# EAGLE design half-stick (EAGLE 6.5.0)
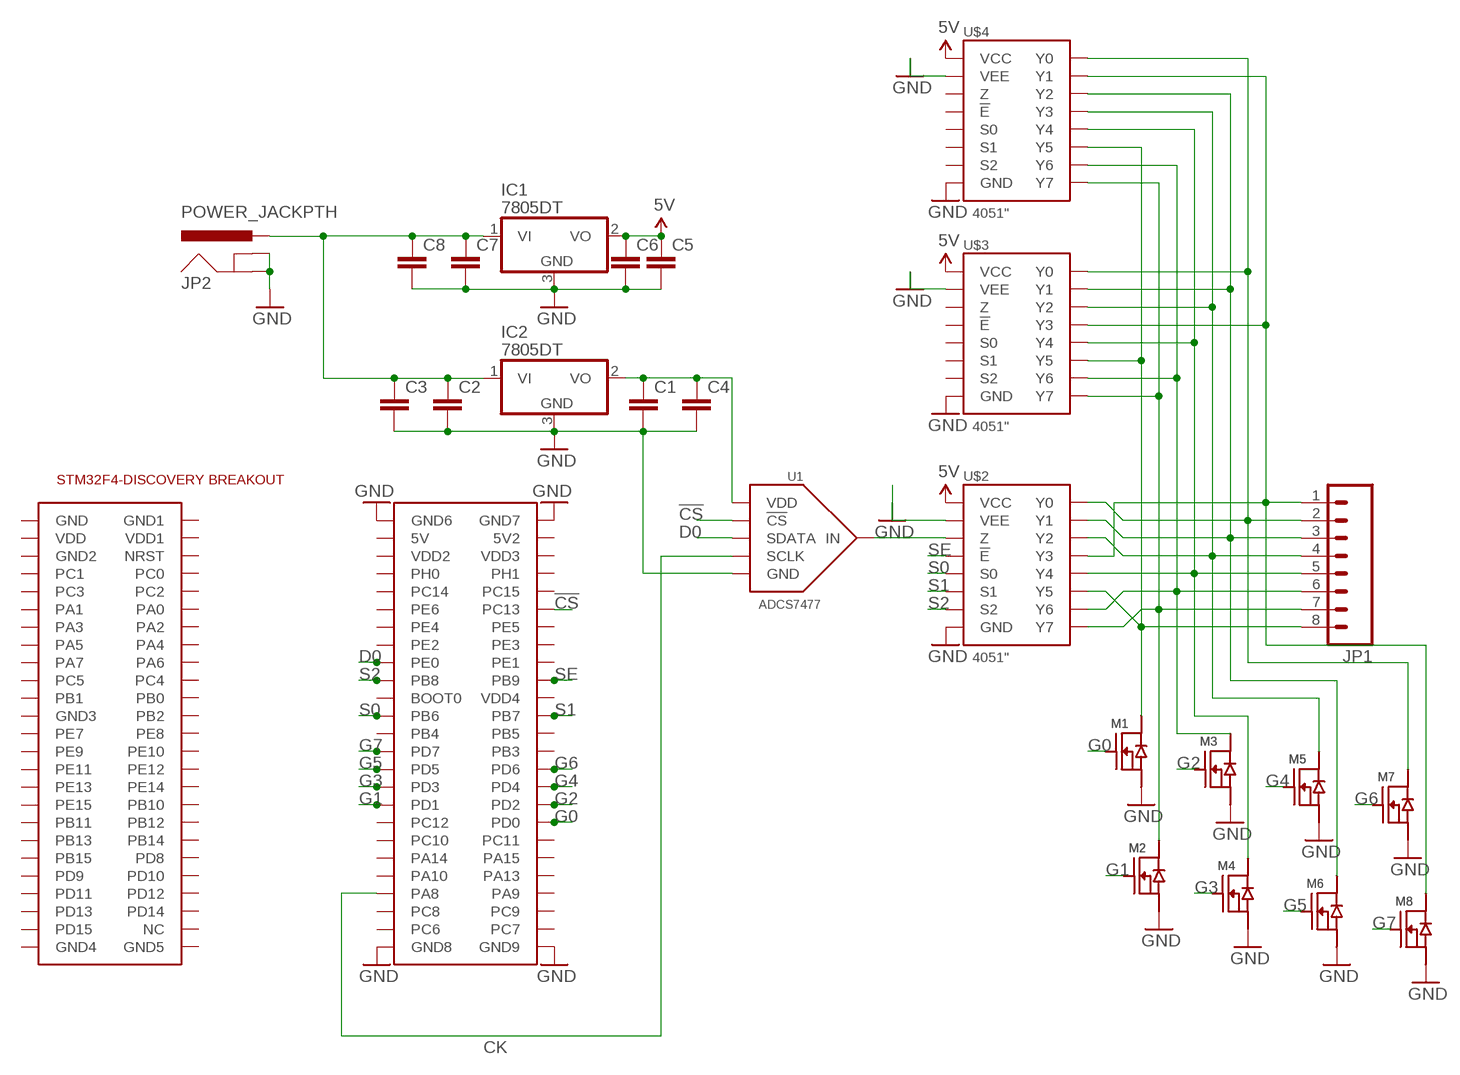
[diagram p0: schematic, sheet 1]

## Parts
C1  C-EUC0805  [C0805]
C2  C-EUC0805  [C0805]
C3  C-EUC0805  [C0805]
C4  C-EUC0805  [C0805]
C5  C-EUC0805  [C0805]
C6  C-EUC0805  [C0805]
C7  C-EUC0805  [C0805]
C8  C-EUC0805  [C0805]
IC1  7805DT  [TO252]
IC2  7805DT  [TO252]
JP1  M08LONGPADS  [1X08_LONGPADS]
JP2  POWER_JACKPTH  [POWER_JACK_PTH]
M1  N-FET  [SOT23-3]
M2  N-FET  [SOT23-3]
M3  N-FET  [SOT23-3]
M4  N-FET  [SOT23-3]
M5  N-FET  [SOT23-3]
M6  N-FET  [SOT23-3]
M7  N-FET  [SOT23-3]
M8  N-FET  [SOT23-3]
U1  ADCS7477  [SOT-23-6]
U$1  STM32F4-DISCOVERY  [STM32F4-DISCOVERY]
U$2  4051"  [TSSOP-16]
U$3  4051"  [TSSOP-16]
U$4  4051"  [TSSOP-16]

## Nets
5V: C5.1 C6.1 IC1.2(VO) U$2.P$16(VCC) U$3.P$16(VCC) U$4.P$16(VCC)
!CS: U1.P$6(!CS) U$1.P$62(PC13)
CK: U1.P$4(SCLK) U$1.P$93(PA8)
D0: U1.P$5(SDATA) U$1.P$67(PE0)
G0: M1.1(G) U$1.P$86(PD0)
G1: M2.1(G) U$1.P$83(PD1)
G2: M3.1(G) U$1.P$84(PD2)
G3: M4.1(G) U$1.P$81(PD3)
G4: M5.1(G) U$1.P$82(PD4)
G5: M6.1(G) U$1.P$79(PD5)
G6: M7.1(G) U$1.P$80(PD6)
G7: M8.1(G) U$1.P$77(PD7)
GND: C1.2 C2.2 C3.2 C4.2 C5.2 C6.2 C7.2 C8.2 IC1.3(GND) IC2.3(GND) JP2.GND JP2.GNDBREAK M1.2(S) M2.2(S) M3.2(S) M4.2(S) M5.2(S) M6.2(S) M7.2(S) M8.2(S) U1.P$2(GND) U$1.P$51(GND6) U$1.P$52(GND7) U$1.P$99(GND8) U$1.P$100(GND9) U$2.P$7(VEE) U$2.P$8(GND) U$3.P$7(VEE) U$3.P$8(GND) U$4.P$7(VEE) U$4.P$8(GND)
N$1: U1.P$3(IN) U$2.P$3(Z)
N$2: C1.1 C4.1 IC2.2(VO) U1.P$1(VDD)
N$5: C2.1 C3.1 C7.1 C8.1 IC1.1(VI) IC2.1(VI) JP2.PWR
N$8: JP1.1 M8.3(D) U$2.P$12(Y3) U$3.P$12(Y3) U$4.P$14(Y1)
N$9: JP1.2 M7.3(D) U$2.P$13(Y0) U$3.P$13(Y0) U$4.P$13(Y0)
N$10: JP1.3 M6.3(D) U$2.P$14(Y1) U$3.P$14(Y1) U$4.P$15(Y2)
N$11: JP1.4 M5.3(D) U$2.P$15(Y2) U$3.P$15(Y2) U$4.P$12(Y3)
N$12: JP1.5 M4.3(D) U$2.P$1(Y4) U$3.P$1(Y4) U$4.P$1(Y4)
N$13: JP1.6 M3.3(D) U$2.P$2(Y6) U$3.P$2(Y6) U$4.P$2(Y6)
N$14: JP1.7 M2.3(D) U$2.P$4(Y7) U$3.P$4(Y7) U$4.P$4(Y7)
N$15: JP1.8 M1.3(D) U$2.P$5(Y5) U$3.P$5(Y5) U$4.P$5(Y5)
S0: U$1.P$73(PB6) U$2.P$11(S0)
S1: U$1.P$74(PB7) U$2.P$10(S1)
S2: U$1.P$69(PB8) U$2.P$9(S2)
SE: U$1.P$70(PB9) U$2.P$6(!E)
Unconnected: U$1.P$1(GND) U$1.P$2(GND1) U$1.P$3(VDD) U$1.P$4(VDD1) U$1.P$5(GND2) U$1.P$6(NRST) U$1.P$7(PC1) U$1.P$8(PC0) U$1.P$9(PC3) U$1.P$10(PC2) U$1.P$11(PA1) U$1.P$12(PA0) U$1.P$13(PA3) U$1.P$14(PA2) U$1.P$15(PA5) U$1.P$16(PA4) U$1.P$17(PA7) U$1.P$18(PA6) U$1.P$19(PC5) U$1.P$20(PC4) U$1.P$21(PB1) U$1.P$22(PB0) U$1.P$23(GND3) U$1.P$24(PB2) U$1.P$25(PE7) U$1.P$26(PE8) U$1.P$27(PE9) U$1.P$28(PE10) U$1.P$29(PE11) U$1.P$30(PE12) U$1.P$31(PE13) U$1.P$32(PE14) U$1.P$33(PE15) U$1.P$34(PB10) U$1.P$35(PB11) U$1.P$36(PB12) U$1.P$37(PB13) U$1.P$38(PB14) U$1.P$39(PB15) U$1.P$40(PD8) U$1.P$41(PD9) U$1.P$42(PD10) U$1.P$43(PD11) U$1.P$44(PD12) U$1.P$45(PD13) U$1.P$46(PD14) U$1.P$47(PD15) U$1.P$48(NC) U$1.P$49(GND4) U$1.P$50(GND5) U$1.P$53(5V) U$1.P$54(5V2) U$1.P$55(VDD2) U$1.P$56(VDD3) U$1.P$57(PH0) U$1.P$58(PH1) U$1.P$59(PC14) U$1.P$60(PC15) U$1.P$61(PE6) U$1.P$63(PE4) U$1.P$64(PE5) U$1.P$65(PE2) U$1.P$66(PE3) U$1.P$68(PE1) U$1.P$71(BOOT0) U$1.P$72(VDD4) U$1.P$75(PB4) U$1.P$76(PB5) U$1.P$78(PB3) U$1.P$85(PC12) U$1.P$87(PC10) U$1.P$88(PC11) U$1.P$89(PA14) U$1.P$90(PA15) U$1.P$91(PA10) U$1.P$92(PA13) U$1.P$94(PA9) U$1.P$95(PC8) U$1.P$96(PC9) U$1.P$97(PC6) U$1.P$98(PC7) U$3.P$3(Z) U$3.P$6(!E) U$3.P$9(S2) U$3.P$10(S1) U$3.P$11(S0) U$4.P$3(Z) U$4.P$6(!E) U$4.P$9(S2) U$4.P$10(S1) U$4.P$11(S0)

## Library data of the parts
C1-C8 = rcl:C-EU: CAPACITOR, European symbol
IC1 IC2 = linear:78*: Positive VOLTAGE REGULATOR Source: http://cache.national.com/ds/LM/LM78L05.pdf http://www.fairchildsemi.com/ds/LM/LM7805.pdf
JP1 = SparkFun-Connectors:M08: Header 8 Standard 8-pin 0.1" header. Use with straight break away headers (SKU : PRT-00116), right angle break away headers (PRT-00553), swiss pins (PRT-00743), machine pins (PRT-00117), and female headers (PRT-00115).
JP2 = SparkFun-Connectors:POWER_JACK: Power Jack This is the standard 5.5mm barrel jack for power. The PTH is the most common, proven, reliable, footprint. The Slot footprint only works if the mill layer is transmitted to the PCB fab house so be warned. Mating wall wart : TOL-00298 (and others); PROD_ID: CONN-08197
M1-M8 = butter:N-FET
U1 = butter:ADCS7477: TI ADCS7477 10 bit 1MSPS ADC 5V 10mW Digikey <http://www.digikey.com/product-detail/en/ADCS7477AIMF%2FNOPB/ADCS7477AIMF%2FNOPBTR-ND/568478>
U$1 = STM32F4-DISCOVERY:STM32F4-DISCOVERY
U$2-U$4 = butter:4051: 74HC4051PW NXP 8:1 Analog Multiplexer digikey <http://www.digikey.com/product-detail/en/74HC4051PW,118/568-2259-1-ND/946721>

## Board
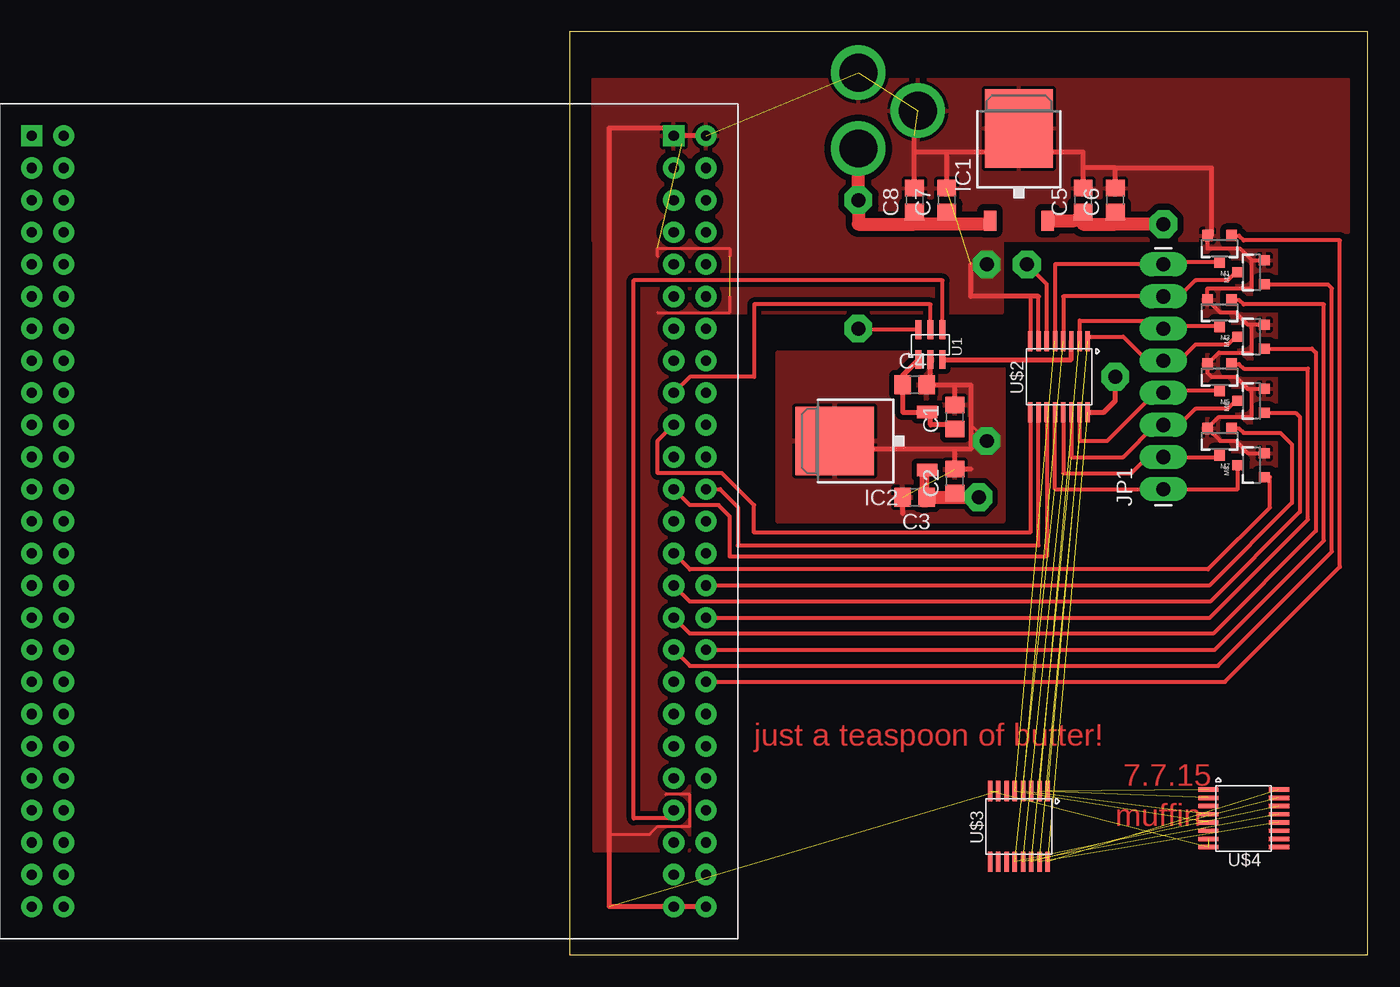
[diagram p1: board, top side]
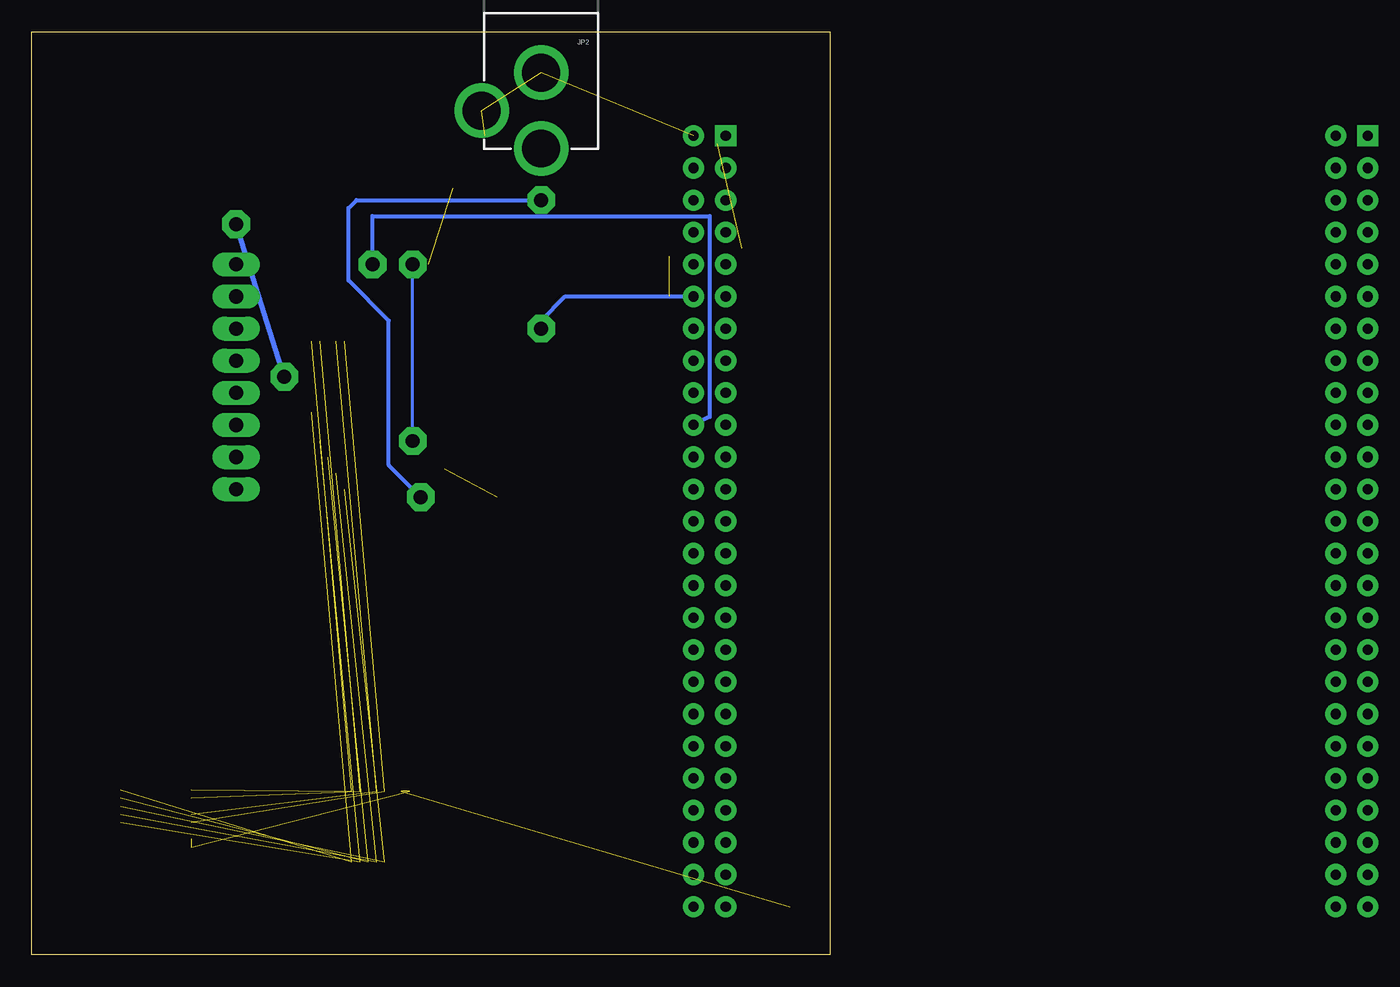
[diagram p2: board, bottom side, seen from below]

Size 63.17 x 73.02 mm. Coordinates in mm from the lower left corner, seen from the top.
Outline: 0,0 63.17,0 63.17,73.02 0,73.02 0,0
Copper layers (1*16): Top 0.035mm / dielectric 1.5mm / Bottom 0.035mm
Design rules "default": minimum track width 10mil, minimum drill 24mil, track to track 8mil, track to pad 8mil, pad to pad 8mil, via to via 8mil, smd to smd 8mil, copper to edge 40mil, drill to drill 8mil, minimum pad ring 10mil, minimum via ring 8mil, stop-mask expansion 4mil, vias tented up to drill 0mil, thermal gap 10mil

### Footprints (pad centres in the part's own frame; a part is rotated, then mirrored left to right if it is on the bottom)
C0805 = smd 1.3 x 1.5: 1 -0.95,0; 2 0.95,0
TO252 = smd 1 x 1.6: 1 -2.28,-4.8; 2 2.28,-4.8 | smd 5.4 x 6.2: 3 0,2.5
1X08_LONGPADS = drill 1.118 pad 1.88 long: 1 0,0; 2 2.54,0; 3 5.08,0; 4 7.62,0; 5 10.16,0; 6 12.7,0; 7 15.24,0; 8 17.78,0
POWER_JACK_PTH = drill 2.997 pad 4.318: GND 0,7.7; GNDBREAK 4.7,10.7; PWR 0,13.7
SOT23-3 = smd 0.8 x 0.9: 1 -0.95,-1; 2 0.95,-1; 3 0,1.1
SOT-23-6 = smd 1.473 x 0.483: P$1 -1.181,0.95; P$2 -1.181,0; P$3 -1.181,-0.95; P$4 1.181,-0.95; P$5 1.181,0; P$6 1.181,0.95
STM32F4-DISCOVERY = drill 0.8 pad 1.676 square: P$1 -27.94,30.48; P$51 22.86,30.48 | drill 0.8 pad 1.676: P$2 -25.4,30.48; P$3 -27.94,27.94; P$4 -25.4,27.94; P$5 -27.94,25.4; P$6 -25.4,25.4; P$7 -27.94,22.86; P$8 -25.4,22.86; P$9 -27.94,20.32; P$10 -25.4,20.32; P$11 -27.94,17.78; P$12 -25.4,17.78; P$13 -27.94,15.24; P$14 -25.4,15.24; P$15 -27.94,12.7; P$16 -25.4,12.7; P$17 -27.94,10.16; P$18 -25.4,10.16; P$19 -27.94,7.62; P$20 -25.4,7.62; P$21 -27.94,5.08; P$22 -25.4,5.08; P$23 -27.94,2.54; P$24 -25.4,2.54; P$25 -27.94,0; P$26 -25.4,0; P$27 -27.94,-2.54; P$28 -25.4,-2.54; P$29 -27.94,-5.08; P$30 -25.4,-5.08; P$31 -27.94,-7.62; P$32 -25.4,-7.62; P$33 -27.94,-10.16; P$34 -25.4,-10.16; P$35 -27.94,-12.7; P$36 -25.4,-12.7; P$37 -27.94,-15.24; P$38 -25.4,-15.24; P$39 -27.94,-17.78; P$40 -25.4,-17.78; P$41 -27.94,-20.32; P$42 -25.4,-20.32; P$43 -27.94,-22.86; P$44 -25.4,-22.86; P$45 -27.94,-25.4; P$46 -25.4,-25.4; P$47 -27.94,-27.94; P$48 -25.4,-27.94; P$49 -27.94,-30.48; P$50 -25.4,-30.48; P$52 25.4,30.48; P$53 22.86,27.94; P$54 25.4,27.94; P$55 22.86,25.4; P$56 25.4,25.4; P$57 22.86,22.86; P$58 25.4,22.86; P$59 22.86,20.32; P$60 25.4,20.32; P$61 22.86,17.78; P$62 25.4,17.78; P$63 22.86,15.24; P$64 25.4,15.24; P$65 22.86,12.7; P$66 25.4,12.7; P$67 22.86,10.16; P$68 25.4,10.16; P$69 22.86,7.62; P$70 25.4,7.62; P$71 22.86,5.08; P$72 25.4,5.08; P$73 22.86,2.54; P$74 25.4,2.54; P$75 22.86,0; P$76 25.4,0; P$77 22.86,-2.54; P$78 25.4,-2.54; P$79 22.86,-5.08; P$80 25.4,-5.08; P$81 22.86,-7.62; P$82 25.4,-7.62; P$83 22.86,-10.16; P$84 25.4,-10.16; P$85 22.86,-12.7; P$86 25.4,-12.7; P$87 22.86,-15.24; P$88 25.4,-15.24; P$89 22.86,-17.78; P$90 25.4,-17.78; P$91 22.86,-20.32; P$92 25.4,-20.32; P$93 22.86,-22.86; P$94 25.4,-22.86; P$95 22.86,-25.4; P$96 25.4,-25.4; P$97 22.86,-27.94; P$98 25.4,-27.94; P$99 22.86,-30.48; P$100 25.4,-30.48
TSSOP-16 = smd 1.6 x 0.35: P$1 -2.8,2.275; P$2 -2.8,1.625; P$3 -2.8,0.975; P$4 -2.8,0.325; P$5 -2.8,-0.325; P$6 -2.8,-0.975; P$7 -2.8,-1.625; P$8 -2.8,-2.275; P$9 2.8,-2.275; P$10 2.8,-1.625; P$11 2.8,-0.975; P$12 2.8,-0.325; P$13 2.8,0.325; P$14 2.8,0.975; P$15 2.8,1.625; P$16 2.8,2.275

### Placement (x,y rotation side)
C1  30.48,42.55 90 top
C2  30.48,37.47 90 top
C3  27.3,36.2 180 top
C4  27.3,45.09 0 top
C5  40.64,59.69 90 top
C6  43.18,59.69 90 top
C7  29.85,59.69 90 top
C8  27.3,59.69 90 top
IC1  35.56,62.87 0 top
IC2  23.49,40.64 90 top
JP1  46.99,36.83 90 top
JP2  22.86,77.47 180 bottom
M1  51.43,55.88 180 top
M2  53.98,53.98 90 top
M3  51.43,50.8 180 top
M4  53.98,48.9 90 top
M5  51.43,45.72 180 top
M6  53.98,43.81 90 top
M7  51.43,40.64 180 top
M8  53.98,38.73 90 top
U1  28.57,48.26 90 top
U$1  -14.61,34.29 0 top
U$2  38.73,45.72 270 top
U$3  35.56,10.16 270 top
U$4  53.34,10.79 0 top

### Tracks (layer width: path | path; a pad name or v marks a point on that pad's centre or on a via)
5V  (via drill 1.1 pad 2.18)  (2 unrouted)
  Top 0.406: 39.96,58.06 C5.1 40.64,57.78 | 43.18,57.78 C6.1 | U$2.P$16 42.29,42.92 43.18,43.81 v43.18,45.72
  Top 1.016: IC1.2 39.96,58.06 | 40.64,57.78 43.18,57.78 v46.99,57.78
  Bottom 0.406: v43.18,45.72 v46.99,57.78
!CS  (via drill 1.1 pad 2.18)
  Top 0.305: U1.P$6 22.95,49.44 v22.86,49.53
  Bottom 0.305: v22.86,49.53 22.86,50.16 20.96,52.07 U$1.P$62
CK
  Top 0.305: 8.26,10.79 5.08,10.79 5.08,53.34 29.52,53.34 U1.P$4
  Top 0.406: U$1.P$93 8.26,10.79
D0
  Top 0.305: U1.P$5 28.57,51.44 14.6,51.44 14.6,45.72 9.52,45.72 U$1.P$67
G0
  Top 0.305: M1.1 52.98,56.88 53.34,56.52 60.96,56.52 60.96,30.68 51.87,21.59 U$1.P$86
G1
  Top 0.305: M2.1 60.01,53.02 60.32,52.7 60.32,31.89 51.3,22.86 9.52,22.86 U$1.P$83
G2
  Top 0.305: M3.1 52.98,51.8 53.34,51.44 59.69,51.44 59.69,32.77 51.05,24.13 U$1.P$84
G3
  Top 0.305: M4.1 58.73,47.95 59.05,47.62 59.05,33.53 50.92,25.4 9.52,25.4 U$1.P$81
G4
  Top 0.305: M5.1 52.98,46.72 53.34,46.35 58.42,46.35 58.42,34.42 50.67,26.67 U$1.P$82
G5
  Top 0.305: M6.1 57.46,42.87 57.79,42.55 57.79,35.04 50.68,27.94 9.52,27.94 U$1.P$79
G6
  Top 0.305: M7.1 52.98,41.64 53.34,41.27 56.25,41.27 57.15,40.38 57.15,35.75 50.61,29.21 U$1.P$80
G7
  Top 0.305: U$1.P$77 9.52,30.48 50.52,30.48 55.43,35.38 55.43,37.78 M8.1
GND  (via drill 1.1 pad 2.18)  (11 unrouted)
  Top 0.254: 7.62,12.7 9.52,12.7 9.52,10.16 6.98,10.16 6.35,9.53 3.17,9.53 | 6.98,50.8 12.7,50.8 12.7,52.07 | 6.98,55.24 6.98,55.88 12.7,55.88 12.7,55.24 | 31.75,45.09 31.75,41.91 v33.02,40.64 | v33.02,54.61 31.75,54.61
  Top 0.305: 53.98,54.92 53.98,52.7 50.48,52.7 M3.2 51.48,50.8 52.71,50.8 53.66,49.84 53.98,49.84 | 53.98,54.92 M2.2 | M1.2 50.48,55.88 53.02,55.88 53.98,54.92 | M4.2 53.98,49.84 | 53.98,44.77 53.66,44.77 52.71,45.72 50.8,45.72 50.48,46.03 M5.2 51.39,47.62 53.98,47.62 53.98,49.84 | 53.98,44.77 M6.2 | M8.2 53.66,39.69 52.71,40.64 51.48,40.64 M7.2 51.39,42.55 53.98,42.55 53.98,44.77 | U$2.P$7 37.11,52.07 36.46,52.07 U$2.P$8
  Top 0.406: 43.18,62.23 40.64,62.23 | 40.64,62.23 C5.2 | IC1.3 35.56,63.5 | 35.56,63.5 40.64,63.5 40.64,62.23 | C8.2 27.3,63.5 | 27.3,63.5 29.85,63.5 | 29.85,63.5 C7.2 | 29.85,63.5 35.56,63.5 | 27.3,63.5 27.3,64.77 | U$1.P$52 U$1.P$51 8.89,64.77 | C6.2 43.18,62.23 | 43.18,62.23 50.8,62.23 50.8,56.88 M1.2 | U$1.P$100 U$1.P$99 3.17,3.81 3.17,9.53 3.17,65.41 8.89,65.41 8.89,64.77 | 8.89,64.14 8.89,64.77 | 37.11,52.07 31.75,52.07 31.75,54.61 | U1.P$2 28.57,45.09 C4.2 30.48,45.09 | 30.48,45.09 31.75,45.09 31.75,40.01 30.48,40.01 | 30.48,40.01 20.96,40.01 20.96,40.64 IC2.3 | C1.2 30.48,45.09 | 30.48,40.01 C2.2 31.75,38.41 | C3.2 26.35,34.92
  Bottom 0.254: v33.02,40.64 v33.02,54.61
  pour Top (isolate 0.406): 1.91,8.26 9.52,8.26 9.52,13.97 8.26,13.97 8.26,50.8 34.29,50.8 34.29,56.52 1.91,56.52
  pour Top (isolate 0.406): 16.51,47.62 34.29,47.62 34.29,34.29 16.51,34.29
  pour Top (isolate 0.508): 1.91,57.15 1.91,69.22 61.6,69.22 61.6,57.15 55.88,57.15 55.88,36.83 50.16,36.83 50.16,56.52 1.91,56.52
N$1
  Top 0.406: U1.P$3 39.71,47.08 U$2.P$3
N$2
  Top 0.406: U1.P$1 26.35,45.81 C4.1 26.35,42.92 IC2.2 28.57,42.92 28.57,41.91 30.48,41.91 C1.1
N$5  (via drill 1.1 pad 2.18)
  Top 0.305: IC2.1 28.29,36.48 28.57,36.2 28.57,35.56
  Top 0.406: IC1.1 33.28,57.78 | C7.1 29.85,57.78 | 27.3,57.78 C8.1 | IC2.1 27.94,38.36 27.94,35.56 28.26,35.56 C3.1 28.57,36.2 30.48,36.2 C2.1
  Top 1.016: 33.28,57.78 29.85,57.78 27.3,57.78 22.86,57.78 v22.86,59.69 JP2.PWR | 28.57,36.2 v32.38,36.2
  Bottom 0.305: v32.38,36.2 34.93,38.73 34.93,50.16 38.1,53.34 38.1,59.05 37.46,59.69 v22.86,59.69
N$8  (2 unrouted)
  Top 0.305: U$2.P$12 38.41,36.83 JP1.1 52.87,36.83 M8.3
N$9  (2 unrouted)
  Top 0.305: M7.3 51.43,39.37 JP1.2 45.72,39.37 44.45,38.1 39.06,38.1 U$2.P$13
N$10  (2 unrouted)
  Top 0.305: M6.3 52.71,43.81 52.07,43.18 49.53,43.18 48.26,41.91 JP1.3 46.35,41.91 43.82,39.37 39.71,39.37 U$2.P$14
N$11  (2 unrouted)
  Top 0.305: M5.3 46.99,44.62 JP1.4 46.35,44.45 42.54,40.64 40.36,40.64 U$2.P$15
N$12  (2 unrouted)
  Top 0.305: M4.3 52.71,48.9 52.07,48.26 49.53,48.26 48.26,46.99 JP1.5 45.72,46.99 43.82,48.9 41.01,48.9 U$2.P$1
N$13  (2 unrouted)
  Top 0.305: U$2.P$2 40.36,50.16 46.99,50.16 JP1.6 47.16,49.7 M3.3
N$14  (2 unrouted)
  Top 0.305: U$2.P$4 39.06,52.07 JP1.7 48.26,52.07 49.53,53.34 52.07,53.34 52.71,53.98 M2.3
N$15  (2 unrouted)
  Top 0.305: U$2.P$5 38.41,54.61 JP1.8 47.16,54.78 M1.3
S0
  Top 0.305: U$1.P$73 9.52,35.56 11.8,35.56 12.7,34.66 12.7,31.5 37.76,31.5 U$2.P$11
S1
  Top 0.305: U$1.P$74 11.91,36.83 13.34,35.41 13.34,32.38 37.11,32.38 U$2.P$10
S2
  Top 0.305: U$2.P$9 36.46,33.4 14.6,33.4 14.6,35.56 12.06,38.1 6.98,38.1 6.98,40.64 U$1.P$69
SE  (via drill 1.1 pad 2.18)
  Top 0.305: U$2.P$6 37.76,53.05 v36.2,54.61
  Bottom 0.305: v36.2,54.61 36.2,58.42 9.52,58.42 9.52,42.55 U$1.P$70

### Text on the board
Top: just a teaspoon of butter! | 7.7.15 | muffin